# Altium schematic sheet EMP_FC_Main.SchDoc
size A4; SheetNumber: 1; SheetTotal: 5
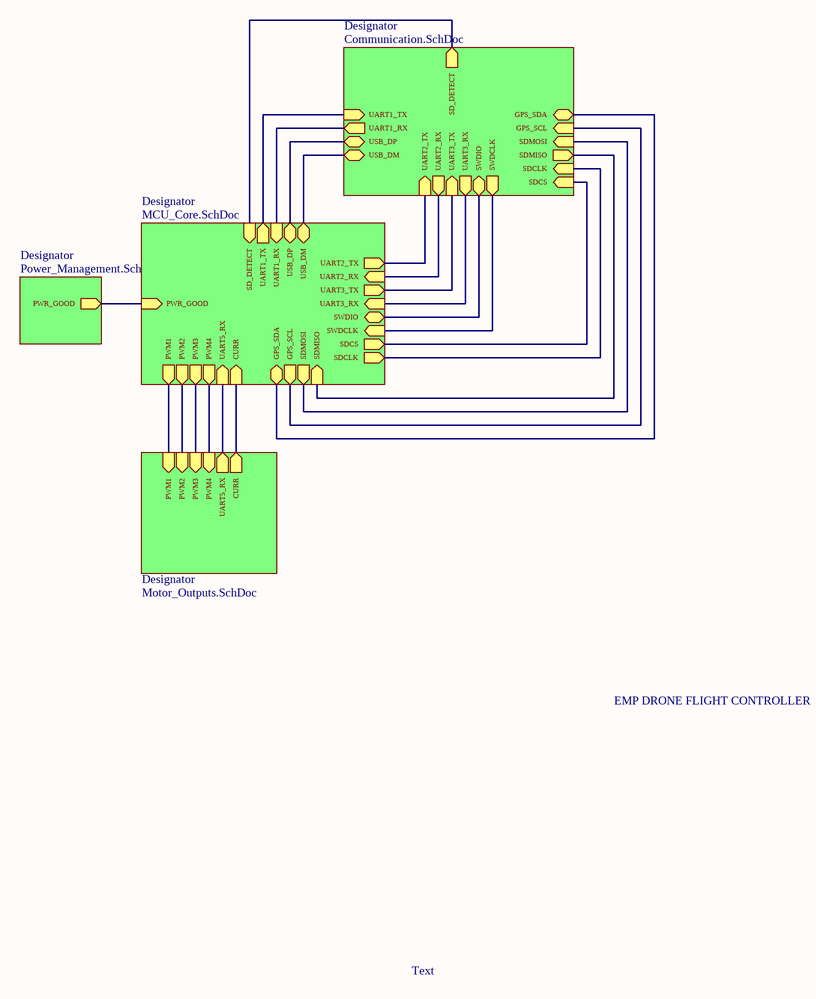
[diagram p0: EMP_FC_Main.SchDoc]

## Sub-sheets
Designator = Power_Management.SchDoc: PWR_GOOD (out)
Designator = MCU_Core.SchDoc: UART1_TX (out), UART1_RX (in), USB_DM (bidir), USB_DP (bidir), PWM4 (out), PWM3 (out), PWM2 (out), PWM1 (out), PWR_GOOD (in), UART5_RX (in), UART2_TX (out), UART3_TX (out), SWDIO (bidir), UART2_RX (in), UART3_RX (in), SWDCLK (in), CURR (in), SDCS (out), SDCLK (out), SDMISO (in), SDMOSI (out), GPS_SDA (bidir), GPS_SCL (out), SD_DETECT (in)
Designator = Communication.SchDoc: UART1_TX (in), UART1_RX (out), USB_DP (bidir), USB_DM (bidir), UART2_RX (out), UART3_RX (out), SWDCLK (out), UART2_TX (in), UART3_TX (in), SWDIO (bidir), SDCS (in), SDCLK (in), SDMISO (out), SDMOSI (in), GPS_SCL (in), GPS_SDA (bidir), SD_DETECT (out)
Designator = Motor_Outputs.SchDoc: PWM1 (in), PWM2 (in), PWM3 (in), PWM4 (in), UART5_RX (out), CURR (out)

## Nets
(unnamed): sheet Designator/PWR_GOOD, sheet Designator/PWR_GOOD
(unnamed): sheet Designator/UART1_TX, sheet Designator/UART1_TX
(unnamed): sheet Designator/UART1_RX, sheet Designator/UART1_RX
(unnamed): sheet Designator/USB_DM, sheet Designator/USB_DM
(unnamed): sheet Designator/USB_DP, sheet Designator/USB_DP
(unnamed): sheet Designator/PWM4, sheet Designator/PWM4
(unnamed): sheet Designator/PWM3, sheet Designator/PWM3
(unnamed): sheet Designator/PWM2, sheet Designator/PWM2
(unnamed): sheet Designator/PWM1, sheet Designator/PWM1
(unnamed): sheet Designator/UART5_RX, sheet Designator/UART5_RX
(unnamed): sheet Designator/UART2_TX, sheet Designator/UART2_TX
(unnamed): sheet Designator/UART3_TX, sheet Designator/UART3_TX
(unnamed): sheet Designator/SWDIO, sheet Designator/SWDIO
(unnamed): sheet Designator/UART2_RX, sheet Designator/UART2_RX
(unnamed): sheet Designator/UART3_RX, sheet Designator/UART3_RX
(unnamed): sheet Designator/SWDCLK, sheet Designator/SWDCLK
(unnamed): sheet Designator/CURR, sheet Designator/CURR
(unnamed): sheet Designator/SDCS, sheet Designator/SDCS
(unnamed): sheet Designator/SDCLK, sheet Designator/SDCLK
(unnamed): sheet Designator/SDMISO, sheet Designator/SDMISO
(unnamed): sheet Designator/SDMOSI, sheet Designator/SDMOSI
(unnamed): sheet Designator/GPS_SDA, sheet Designator/GPS_SDA
(unnamed): sheet Designator/GPS_SCL, sheet Designator/GPS_SCL
(unnamed): sheet Designator/SD_DETECT, sheet Designator/SD_DETECT

## Notes on the sheet
- EMP DRONE FLIGHT CONTROLLER
- Text